# EAGLE design RTC (EAGLE 5.12)
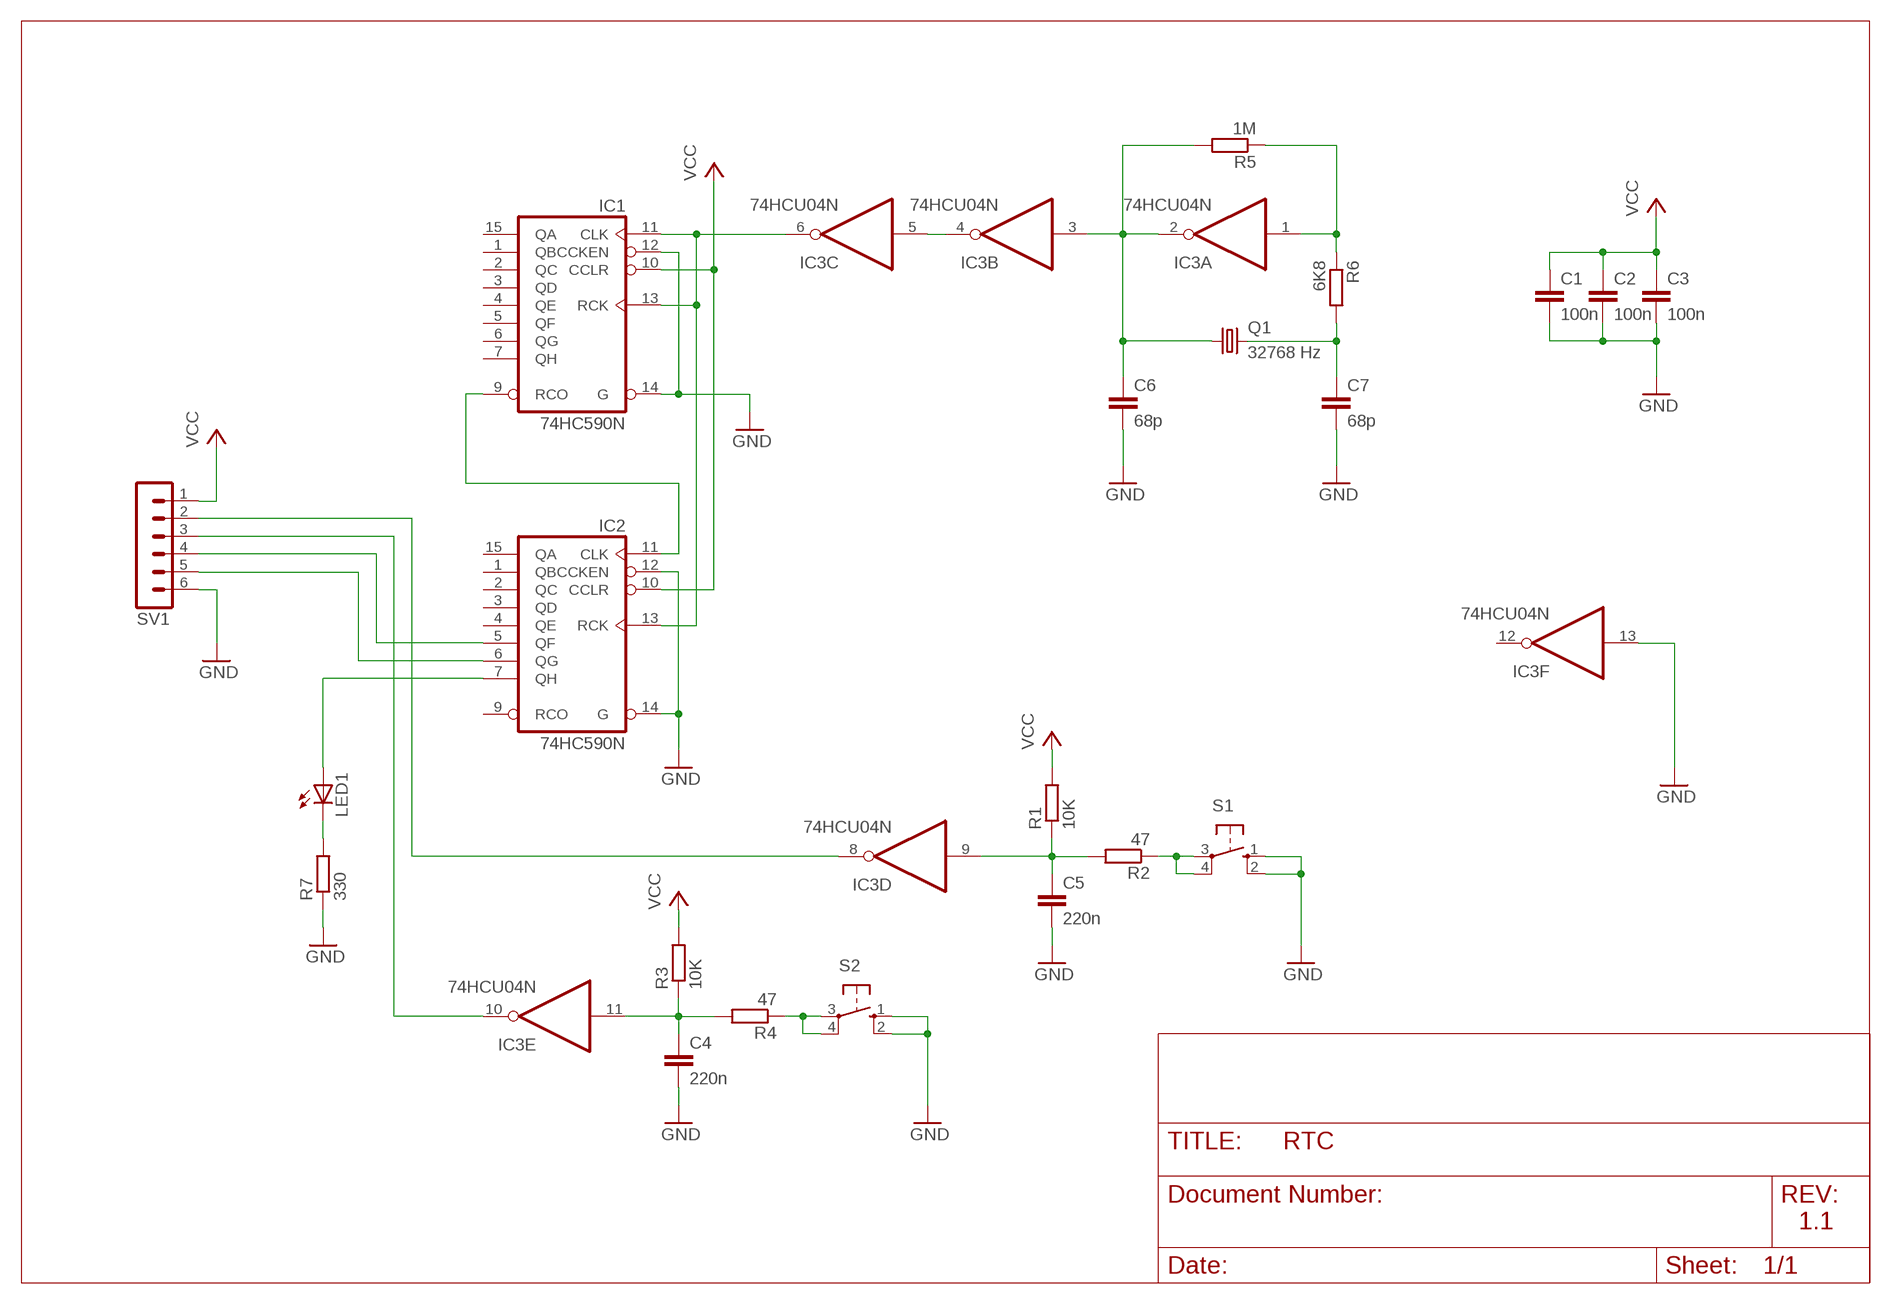
[diagram p0: schematic, sheet 1]

## Parts
C1  100n  C-EU050-024X044  [C050-024X044]
C2  100n  C-EU050-024X044  [C050-024X044]
C3  100n  C-EU050-024X044  [C050-024X044]
C4  220n  C-EU050-024X044  [C050-024X044]
C5  220n  C-EU050-024X044  [C050-024X044]
C6  68p  C-EU025-024X044  [C025-024X044]
C7  68p  C-EU025-024X044  [C025-024X044]
IC1  74HC590N  74LS590N  [DIL16]
IC2  74HC590N  74LS590N  [DIL16]
IC3  74HCU04N  74LS04N  [DIL14]
LED1  LED5MM  [LED5MM]
Q1  32768 Hz  CRYSTALTC26V  [TC26V]
R1  10K  R-EU_0207/7  [0207/7]
R2  47  R-EU_0207/7  [0207/7]
R3  10K  R-EU_0207/7  [0207/7]
R4  47  R-EU_0207/7  [0207/7]
R5  1M  R-EU_0207/7  [0207/7]
R6  6K8  R-EU_0207/7  [0207/7]
R7  330  R-EU_0207/2V  [0207/2V]
S1  10-XX  [B3F-10XX]
S2  10-XX  [B3F-10XX]
SV1  MA06-1  [MA06-1]

## Nets
1HZ: IC2.6(QG) SV1.5
2HZ: IC2.5(QF) SV1.4
CLK: IC1.11(CLK) IC1.13(RCK) IC2.13(RCK) IC3.6(C:O)
GND: C1.2 C2.2 C3.2 C4.2 C5.2 C6.2 C7.2 IC1.12(CCKEN) IC1.14(G) IC2.12(CCKEN) IC2.14(G) IC3.13(F:I) R7.1 S1.1(S) S1.2(S1) S2.1(S) S2.2(S1) SV1.6
N$1: LED1.K(C) R7.2
N$2: IC3.4(B:O) IC3.5(C:I)
N$3: IC2.7(QH) LED1.A
N$7: C6.1 IC3.2(A:O) IC3.3(B:I) Q1.1 R5.2
N$8: IC3.1(A:I) R5.1 R6.1
N$9: C5.1 IC3.9(D:I) R1.1 R2.2
N$10: R2.1 S1.3(P) S1.4(P1)
N$12: C7.1 Q1.2 R6.2
N$13: C4.1 IC3.11(E:I) R3.1 R4.2
N$14: R4.1 S2.3(P) S2.4(P1)
N$15: IC1.9(RCO) IC2.11(CLK)
SWITCH0: IC3.8(D:O) SV1.2
SWITCH1: IC3.10(E:O) SV1.3
VCC: C1.1 C2.1 C3.1 IC1.10(CCLR) IC2.10(CCLR) R1.2 R3.2 SV1.1
Unconnected: IC1.1(QB) IC1.2(QC) IC1.3(QD) IC1.4(QE) IC1.5(QF) IC1.6(QG) IC1.7(QH) IC1.15(QA) IC2.1(QB) IC2.2(QC) IC2.3(QD) IC2.4(QE) IC2.9(RCO) IC2.15(QA) IC3.12(F:O)

## Notes on the sheet
- 1.1

## Power pins joined to a net without a drawn wire
GND: IC1.8(GND) IC2.8(GND) IC3.7(P:GND)
VCC: IC1.16(VCC) IC2.16(VCC) IC3.14(P:VCC)

## Library data of the parts
C1-C7 = rcl:C-EU: CAPACITOR, European symbol
IC1 IC2 = 74xx-us:74*590: 8-bit binary COUNTER, output register
IC3 = 74xx-us:74*04: Hex INVERTER
LED1 = led:LED: LED OSRAM: - CHIPLED LG R971, LG N971, LY N971, LG Q971, LY Q971, LO R971, LY R971 LH N974, LH R974 LS Q976, LO Q976, LY Q976 LO Q996 - Hyper CHIPLED LW Q18S LB Q993, LB Q99A, LB R99A - SideLED LS A670, LO A670, LY A670, LG A670, LP A670 LB A673, LV A673, LT A673, LW A673 LH A674 LY A675 LS A676, LA A676, LO A676, LY A676, LW A676 LS A679, LY A679, LG A679 - Hyper Micro SIDELED® LS Y876, LA Y876, LO Y876, LY Y876 LT Y87S - SmartLED LW L88C, LW L88S LB L89C, LB L89S, LG L890 LS L89K, LO L89K, LY L89K LS L896, LA L896, LO L896, LY L896 - TOPLED LS T670, LO T670, LY T670, LG T670, LP T670 LSG T670, LSP T670, LSY T670, LOP T670, LYG T670 LG T671, LOG T671, LSG T671 LB T673, LV T673, LT T673, LW T673 LH T674 LS T676, LA T676, LO T676, LY T676, LB T676, LH T676, LSB T676, LW T676 LB T67C, LV T67C, LT T67C, LS T67K, LO T67K, LY T67K, LW E67C LS E67B, LA E67B, LO E67B, LY E67B, LB E67C, LV E67C, LT E67C LW T67C LS T679, LY T679, LG T679 LS T770, LO T770, LY T770, LG T770, LP T770 LB T773, LV T773, LT T773, LW T773 LH T774 LS E675, LA E675, LY E675, LS T675 LS T776, LA T776, LO T776, LY T776, LB T776 LHGB T686 LT T68C, LB T68C - Hyper Mini TOPLED® LB M676 - Mini TOPLED Santana® LG M470 LS M47K, LO M47K, LY M47K Source: http://www.osram.convergy.de LUXEON: - LUMILED® LXK2-PW12-R00, LXK2-PW12-S00, LXK2-PW14-U00, LXK2-PW14-V00 LXK2-PM12-R00, LXK2-PM12-S00, LXK2-PM14-U00 LXK2-PE12-Q00, LXK2-PE12-R00, LXK2-PE12-S00, LXK2-PE14-T00, LXK2-PE14-U00 LXK2-PB12-K00, LXK2-PB12-L00, LXK2-PB12-M00, LXK2-PB14-N00, LXK2-PB14-P00, LXK2-PB14-Q00 LXK2-PR12-L00, LXK2-PR12-M00, LXK2-PR14-Q00, LXK2-PR14-R00 LXK2-PD12-Q00, LXK2-PD12-R00, LXK2-PD12-S00 LXK2-PH12-R00, LXK2-PH12-S00 LXK2-PL12-P00, LXK2-PL12-Q00, LXK2-PL12-R00 Source: www.luxeon.com KINGBRIGHT: KA-3528ASYC Source: www.kingbright.com
Q1 = crystal:CRYSTAL: CRYSTAL; OC_FARNELL: unknown; OC_NEWARK: unknown
R1-R7 = rcl:R-EU_: RESISTOR, European symbol
S1 S2 = switch-omron:10-XX: OMRON SWITCH; MPN: B3F-1000; OC_FARNELL: 176432; OC_NEWARK: 36M3542
SV1 = con-lstb:MA06-1: PIN HEADER; OC_FARNELL: unknown; OC_NEWARK: unknown

## Board
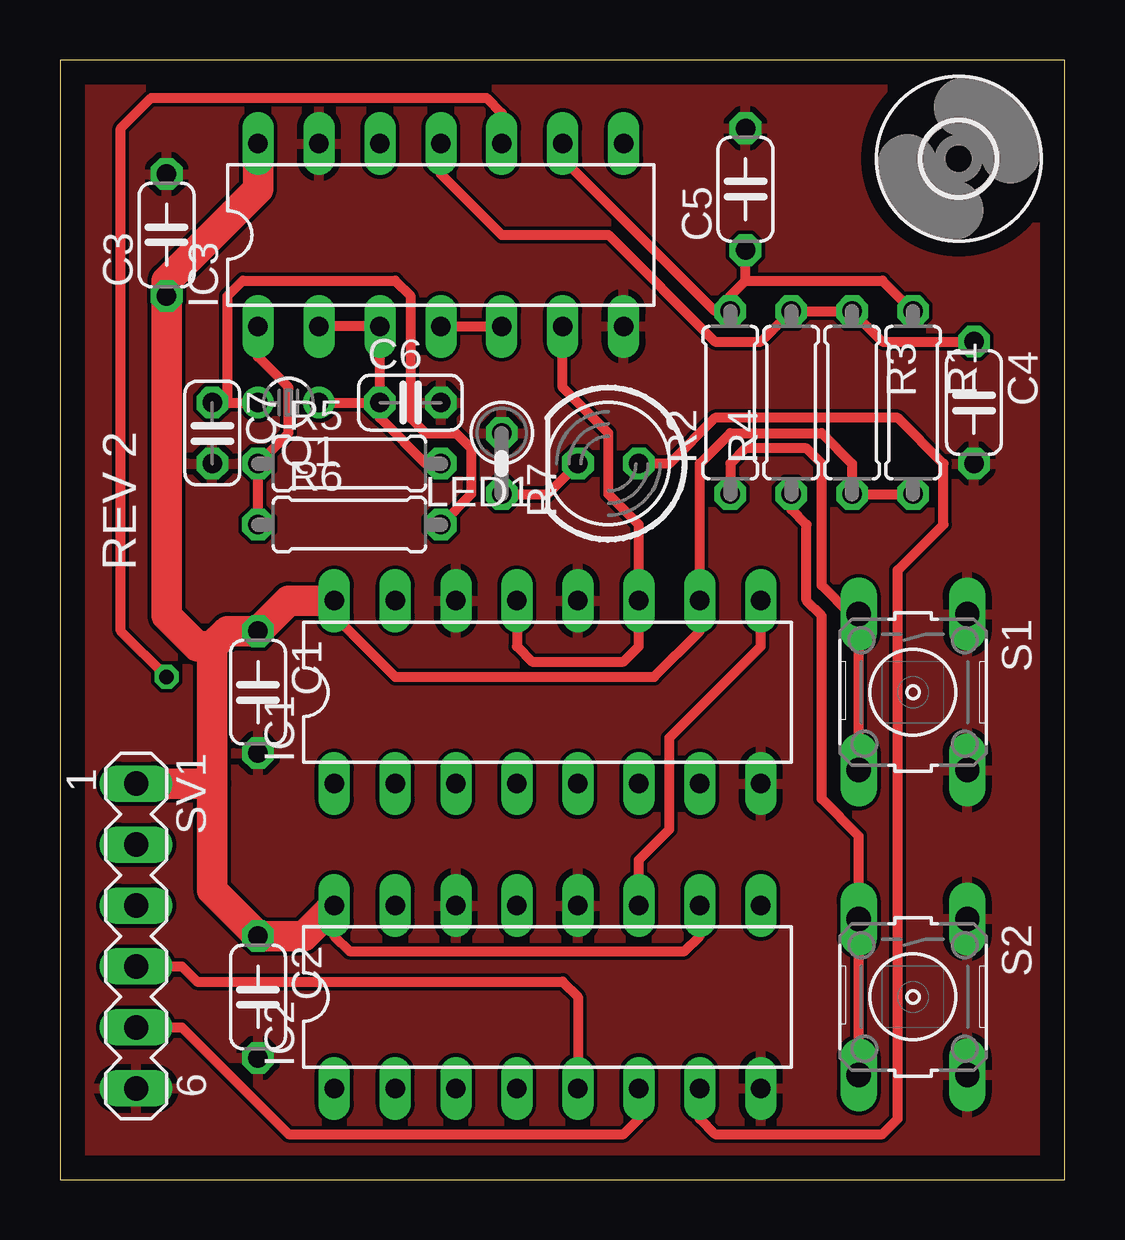
[diagram p1: board, top side]
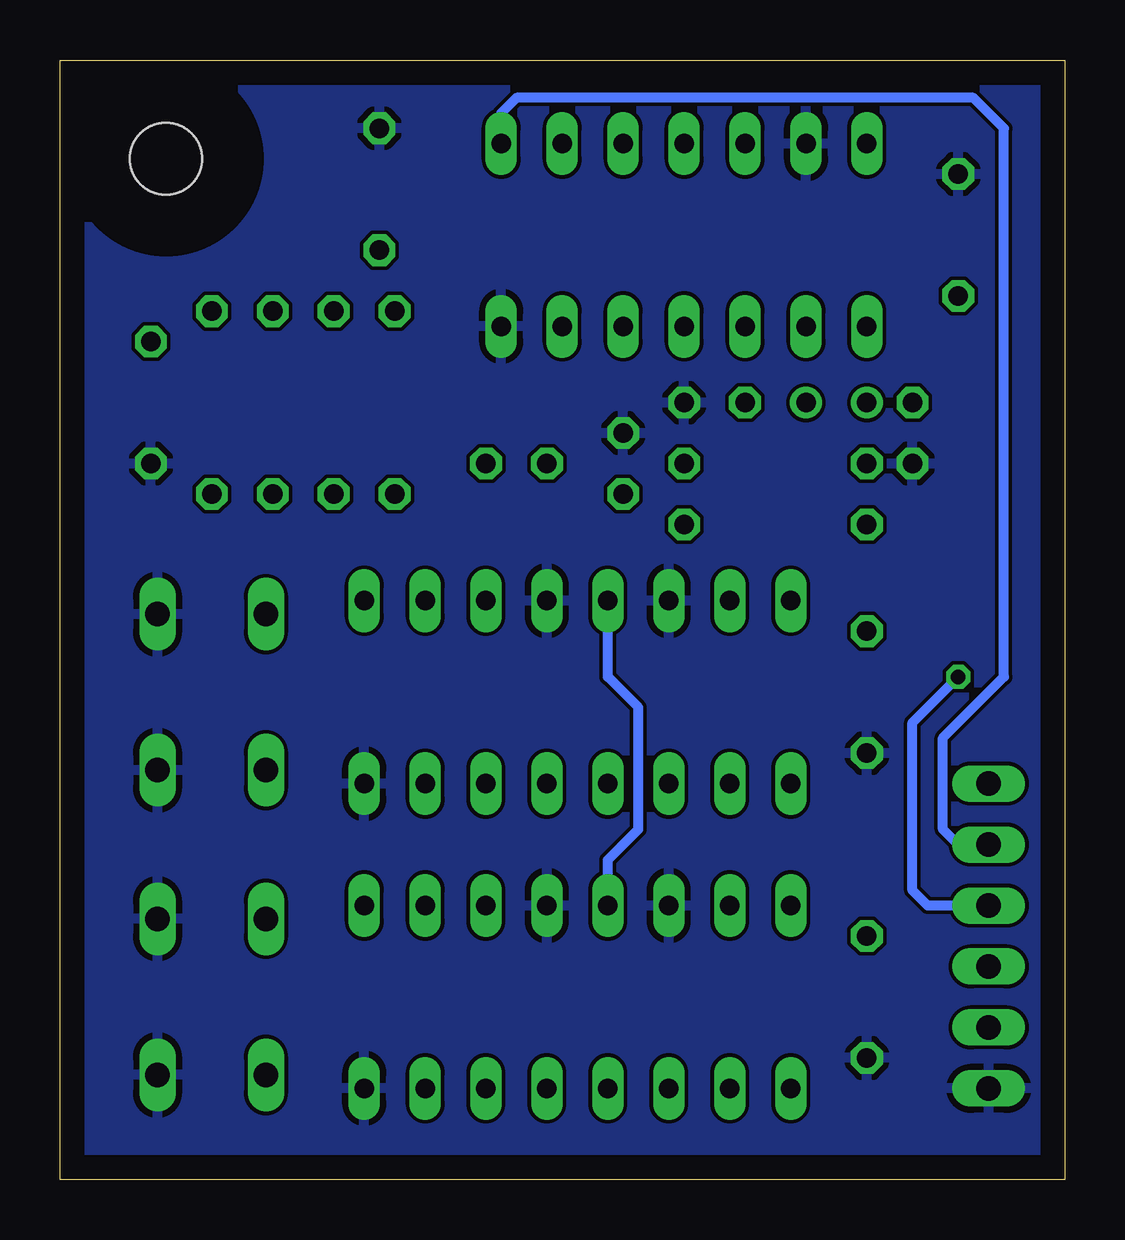
[diagram p2: board, bottom side, seen from below]

Size 41.89 x 46.66 mm. Coordinates in mm from the lower left corner, seen from the top.
Outline: 0,0 41.89,0 41.89,46.66 0,46.66 0,0
Copper layers (1*16): Top 0.035mm / dielectric 1.5mm / Bottom 0.035mm
Design rules "default *": minimum track width 10mil, minimum drill 16mil, track to track 6mil, track to pad 6mil, pad to pad 8mil, via to via 8mil, smd to smd 6mil, copper to edge 40mil, drill to drill 8mil, minimum pad ring 10mil, minimum via ring 8mil, stop-mask expansion 4mil, vias tented up to drill 0mil, thermal gap 10mil

### Footprints (pad centres in the part's own frame; a part is rotated, then mirrored left to right if it is on the bottom)
C050-024X044 = drill 0.813 octagon: 1 -2.54,0; 2 2.54,0
C025-024X044 = drill 0.813 octagon: 1 -1.27,0; 2 1.27,0
DIL16 = drill 0.813 long: 1 -8.89,-3.81; 2 -6.35,-3.81; 3 -3.81,-3.81; 4 -1.27,-3.81; 5 1.27,-3.81; 6 3.81,-3.81; 7 6.35,-3.81; 8 8.89,-3.81; 9 8.89,3.81; 10 6.35,3.81; 11 3.81,3.81; 12 1.27,3.81; 13 -1.27,3.81; 14 -3.81,3.81; 15 -6.35,3.81; 16 -8.89,3.81
DIL14 = drill 0.813 long: 1 -7.62,-3.81; 2 -5.08,-3.81; 3 -2.54,-3.81; 4 0,-3.81; 5 2.54,-3.81; 6 5.08,-3.81; 7 7.62,-3.81; 8 7.62,3.81; 9 5.08,3.81; 10 2.54,3.81; 11 0,3.81; 12 -2.54,3.81; 13 -5.08,3.81; 14 -7.62,3.81
LED5MM = drill 0.813 octagon: A -1.27,0; K 1.27,0
TC26V = drill 0.813 round: 1 -1.27,0; 2 1.27,0
0207/7 = drill 0.813 octagon: 1 -3.81,0; 2 3.81,0
0207/2V = drill 0.813 octagon: 1 -1.27,0; 2 1.27,0
B3F-10XX = drill 1.016 long: 1 -3.251,2.261; 2 3.251,2.261; 3 -3.251,-2.261; 4 3.251,-2.261
MA06-1 = drill 1.016 long: 1 -6.35,0; 2 -3.81,0; 3 -1.27,0; 4 1.27,0; 5 3.81,0; 6 6.35,0
3,0 = hole 3: 0,0

### Placement (x,y rotation side)
C1  8.26,20.32 270 top
C2  8.26,7.62 270 top
C3  4.45,39.37 90 top
C4  38.1,32.38 270 top
C5  28.57,41.27 90 top
C6  14.61,32.38 0 top
C7  6.35,31.11 270 top
IC1  20.32,20.32 0 top
IC2  20.32,7.62 0 top
IC3  15.88,39.37 0 top
LED1  22.86,29.84 180 top
Q1  9.53,32.38 180 top
R1  35.56,32.38 270 top
R2  27.94,32.38 90 top
R3  33.02,32.38 270 top
R4  30.48,32.38 90 top
R5  12.06,29.84 0 top
R6  12.06,27.3 0 top
R7  18.41,29.84 270 top
S1  35.56,20.32 270 top
S2  35.56,7.62 270 top
SV1  3.17,10.16 270 top
U$1  [3,0]  37.47,42.55 0 top

### Tracks (layer width: path | path; a pad name or v marks a point on that pad's centre or on a via)
1HZ
  Top 0.406: IC2.6 24.13,2.54 23.5,1.91 9.53,1.91 5.08,6.35 SV1.5
2HZ
  Top 0.406: SV1.4 5.08,8.89 5.71,8.26 20.95,8.26 21.59,7.62 IC2.5
CLK
  Top 0.406: IC3.6 20.95,33.02 22.86,31.11 22.86,28.57 24.13,27.3 IC1.11 24.13,22.23 23.5,21.59 19.68,21.59 19.05,22.23 IC1.13
  Bottom 0.406: IC2.13 19.05,13.34 17.78,14.61 17.78,19.68 19.05,20.95 IC1.13
GND
  pour Bottom: 0,46.35 41.91,46.35 41.91,0 0,0
  pour Top: 0,46.35 41.91,46.35 41.91,0 0,0
N$1
  Top 0.406: R7.2 20.32,28.57 LED1.K
N$2
  Top 0.406: IC3.4 IC3.5
N$3
  Top 0.406: LED1.A 25.4,29.84 27.3,31.75 34.92,31.75 36.83,29.84 36.83,27.3 34.92,25.4 34.92,2.54 34.29,1.91 27.3,1.91 26.67,2.54 IC2.7
N$7
  Top 0.406: IC3.2 IC3.3 C6.1 | Q1.1 C6.1 | R5.2 15.24,29.84 13.34,31.75 C6.1
N$8
  Top 0.406: R6.1 R5.1 9.53,31.11 9.53,33.02 8.26,34.29 IC3.1
N$9
  Top 0.406: 28.57,37.47 27.94,36.83 R2.2 27.3,36.2 20.95,42.55 IC3.9 | 28.57,37.47 C5.1 | 28.57,37.47 34.29,37.47 R1.1
N$10
  Top 0.406: R2.1 27.94,29.84 28.57,30.48 31.11,30.48 31.75,29.84 31.75,24.77 32.94,23.57 S1.3 S1.4
N$12
  Top 0.406: C7.1 6.99,32.38 | 6.99,32.38 Q1.2 | R6.2 17.14,28.57 17.14,30.48 16.51,31.11 15.24,31.11 14.61,31.75 14.61,36.83 13.97,37.47 7.62,37.47 6.99,36.83 6.99,32.38
N$13
  Top 0.406: C4.1 34.29,34.92 R3.1 R4.2 29.21,34.92 27.3,34.92 22.86,39.37 18.41,39.37 15.88,41.91 IC3.11
N$14
  Top 0.406: R4.1 30.48,27.94 31.11,27.3 31.11,24.13 31.75,23.5 31.75,15.88 33.3,14.33 S2.3 S2.4
N$15
  Top 0.406: IC1.9 29.21,22.23 25.4,18.41 25.4,14.61 24.13,13.34 IC2.11
SWITCH0
  Bottom 0.406: SV1.2 4.45,13.97 5.08,14.61 5.08,18.41 2.54,20.95 2.54,43.81 3.81,45.09 22.86,45.09 23.5,44.45 IC3.8
SWITCH1  (via drill 0.6)
  Top 0.406: v4.45,20.95 2.54,22.86 2.54,43.81 3.81,45.09 17.78,45.09 18.41,44.45 IC3.10
  Bottom 0.406: v4.45,20.95 6.35,19.05 6.35,12.06 5.71,11.43 SV1.3
VCC
  Top 0.406: R1.2 R3.2 33.02,29.84 31.75,31.11 27.94,31.11 26.67,29.84 IC1.10 26.67,22.86 24.77,20.95 13.97,20.95 11.43,23.5 IC1.16 | IC2.10 26.67,10.16 26.04,9.53 12.06,9.53 11.43,10.16 IC2.16
  Top 1.27: IC1.16 9.53,24.13 C1.1 6.99,22.86 6.35,22.23 | 6.35,16.51 SV1.1 | 6.35,16.51 6.35,22.23 | 6.35,16.51 6.35,12.06 C2.1 10.16,10.16 IC2.16 | 6.35,22.23 5.71,22.23 4.45,23.5 C3.1 4.45,37.47 8.26,41.27 IC3.14

### Text on the board
tNames: REV 2